# EAGLE design 7seg (EAGLE 6.6.0)
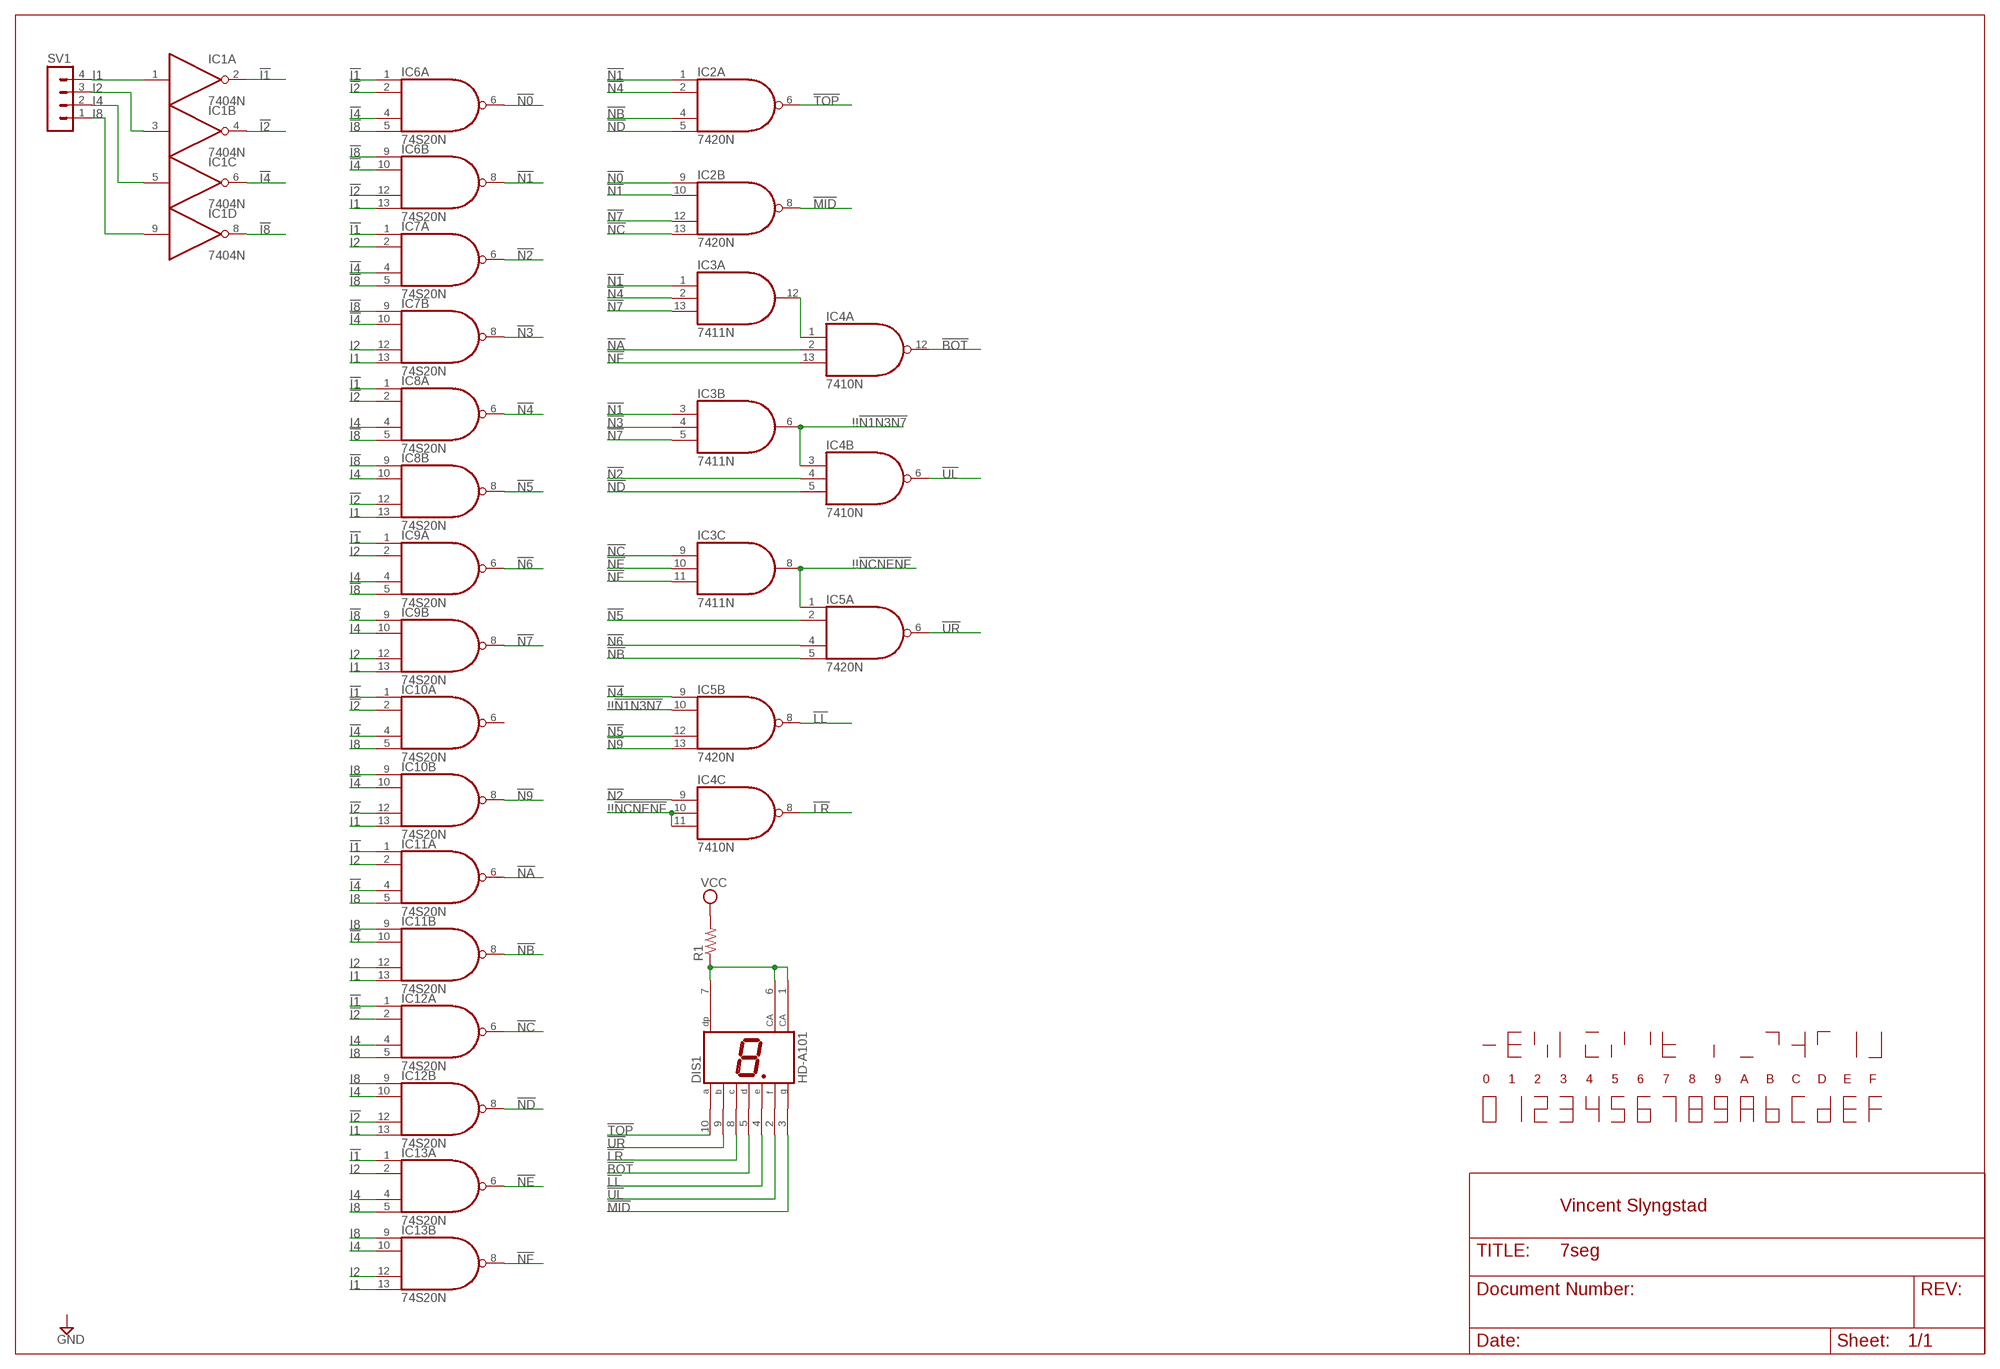
[diagram p0: schematic, sheet 1]

## Parts
DIS1  HD-A101  [HDSP-A]
IC1  7404N  [DIL14]
IC2  7420N  74S20N  [DIL14]
IC3  7411N  74S11N  [DIL14]
IC4  7410N  [DIL14]
IC5  7420N  74S20N  [DIL14]
IC6  74S20N  [DIL14]
IC7  74S20N  [DIL14]
IC8  74S20N  [DIL14]
IC9  74S20N  [DIL14]
IC10  74S20N  [DIL14]
IC11  74S20N  [DIL14]
IC12  74S20N  [DIL14]
IC13  74S20N  [DIL14]
R1  R-US_0207/10  [0207/10]
SV1  MA04-1  [MA04-1]

## Nets
!!!N1N3N7: IC3.6(B:O) IC4.3(B:I0) IC5.10(B:I1)
!!!NCNENF: IC3.8(C:O) IC4.10(C:I1) IC4.11(C:I2) IC5.1(A:I0)
!BOT: DIS1.5(D) IC4.12(A:O)
!I1: IC1.2(A:O) IC6.1(A:I0) IC7.1(A:I0) IC8.1(A:I0) IC9.1(A:I0) IC10.1(A:I0) IC11.1(A:I0) IC12.1(A:I0) IC13.1(A:I0)
!I2: IC1.4(B:O) IC6.2(A:I1) IC6.12(B:I2) IC8.2(A:I1) IC8.12(B:I2) IC10.2(A:I1) IC10.12(B:I2) IC12.2(A:I1) IC12.12(B:I2)
!I4: IC1.6(C:O) IC6.4(A:I2) IC6.10(B:I1) IC7.4(A:I2) IC7.10(B:I1) IC10.4(A:I2) IC10.10(B:I1) IC11.4(A:I2) IC11.10(B:I1)
!I8: IC1.8(D:O) IC6.5(A:I3) IC6.9(B:I0) IC7.5(A:I3) IC7.9(B:I0) IC8.5(A:I3) IC8.9(B:I0) IC9.5(A:I3) IC9.9(B:I0)
!LL: DIS1.4(E) IC5.8(B:O)
!LR: DIS1.8(C) IC4.8(C:O)
!MID: DIS1.3(G) IC2.8(B:O)
!N0: IC2.9(B:I0) IC6.6(A:O)
!N1: IC2.1(A:I0) IC2.10(B:I1) IC3.1(A:I0) IC3.3(B:I0) IC6.8(B:O)
!N2: IC4.4(B:I1) IC4.9(C:I0) IC7.6(A:O)
!N3: IC3.4(B:I1) IC7.8(B:O)
!N4: IC2.2(A:I1) IC3.2(A:I1) IC5.9(B:I0) IC8.6(A:O)
!N5: IC5.2(A:I1) IC5.12(B:I2) IC8.8(B:O)
!N6: IC5.4(A:I2) IC9.6(A:O)
!N7: IC2.12(B:I2) IC3.5(B:I2) IC3.13(A:I2) IC9.8(B:O)
!N9: IC5.13(B:I3) IC10.8(B:O)
!NA: IC4.2(A:I1) IC11.6(A:O)
!NB: IC2.4(A:I2) IC5.5(A:I3) IC11.8(B:O)
!NC: IC2.13(B:I3) IC3.9(C:I0) IC12.6(A:O)
!ND: IC2.5(A:I3) IC4.5(B:I2) IC12.8(B:O)
!NE: IC3.10(C:I1) IC13.6(A:O)
!NF: IC3.11(C:I2) IC4.13(A:I2) IC13.8(B:O)
!TOP: DIS1.10(A) IC2.6(A:O)
!UL: DIS1.2(F) IC4.6(B:O)
!UR: DIS1.9(B) IC5.6(A:O)
I1: IC1.1(A:I) IC6.13(B:I3) IC7.13(B:I3) IC8.13(B:I3) IC9.13(B:I3) IC10.13(B:I3) IC11.13(B:I3) IC12.13(B:I3) IC13.13(B:I3) SV1.4
I2: IC1.3(B:I) IC7.2(A:I1) IC7.12(B:I2) IC9.2(A:I1) IC9.12(B:I2) IC11.2(A:I1) IC11.12(B:I2) IC13.2(A:I1) IC13.12(B:I2) SV1.3
I4: IC1.5(C:I) IC8.4(A:I2) IC8.10(B:I1) IC9.4(A:I2) IC9.10(B:I1) IC12.4(A:I2) IC12.10(B:I1) IC13.4(A:I2) IC13.10(B:I1) SV1.2
I8: IC1.9(D:I) IC10.5(A:I3) IC10.9(B:I0) IC11.5(A:I3) IC11.9(B:I0) IC12.5(A:I3) IC12.9(B:I0) IC13.5(A:I3) IC13.9(B:I0) SV1.1
N$1: IC3.12(A:O) IC4.1(A:I0)
N$2: DIS1.1(CA) DIS1.6(CA) DIS1.7(DP) R1.1
VCC: R1.2
Unconnected: IC1.10(E:O) IC1.11(E:I) IC1.12(F:O) IC1.13(F:I) IC10.6(A:O)

## Notes on the sheet
- 0 | 1 | 2 | 3 | 4 | 5 | 6 | 7 | 8 | 9 | A | B | C | D | E | F
- Vincent Slyngstad

## Power pins joined to a net without a drawn wire
GND: IC1.7(P:GND) IC2.7(P:GND) IC3.7(P:GND) IC4.7(P:GND) IC5.7(P:GND) IC6.7(P:GND) IC7.7(P:GND) IC8.7(P:GND) IC9.7(P:GND) IC10.7(P:GND) IC11.7(P:GND) IC12.7(P:GND) IC13.7(P:GND)
VCC: IC1.14(P:VCC) IC2.14(P:VCC) IC3.14(P:VCC) IC4.14(P:VCC) IC5.14(P:VCC) IC6.14(P:VCC) IC7.14(P:VCC) IC8.14(P:VCC) IC9.14(P:VCC) IC10.14(P:VCC) IC11.14(P:VCC) IC12.14(P:VCC) IC13.14(P:VCC)

## Library data of the parts
DIS1 = display-hp:HD-A101: LED DISPLAY 1-character 7 segment, decimal point right; OC_FARNELL: unknown; OC_NEWARK: unknown
IC1 = 74xx-us:74*04: Hex INVERTER
IC2 IC5-IC13 = 74xx-us:74*20: Dual 4-input NAND gate
IC3 = 74xx-us:74*11: Triple 3-input AND gate
IC4 = 74xx-us:74*10: Triple 3-input NAND gate
R1 = rcl:R-US_: RESISTOR, American symbol
SV1 = con-lstb:MA04-1: PIN HEADER; OC_FARNELL: unknown; OC_NEWARK: unknown

## Board
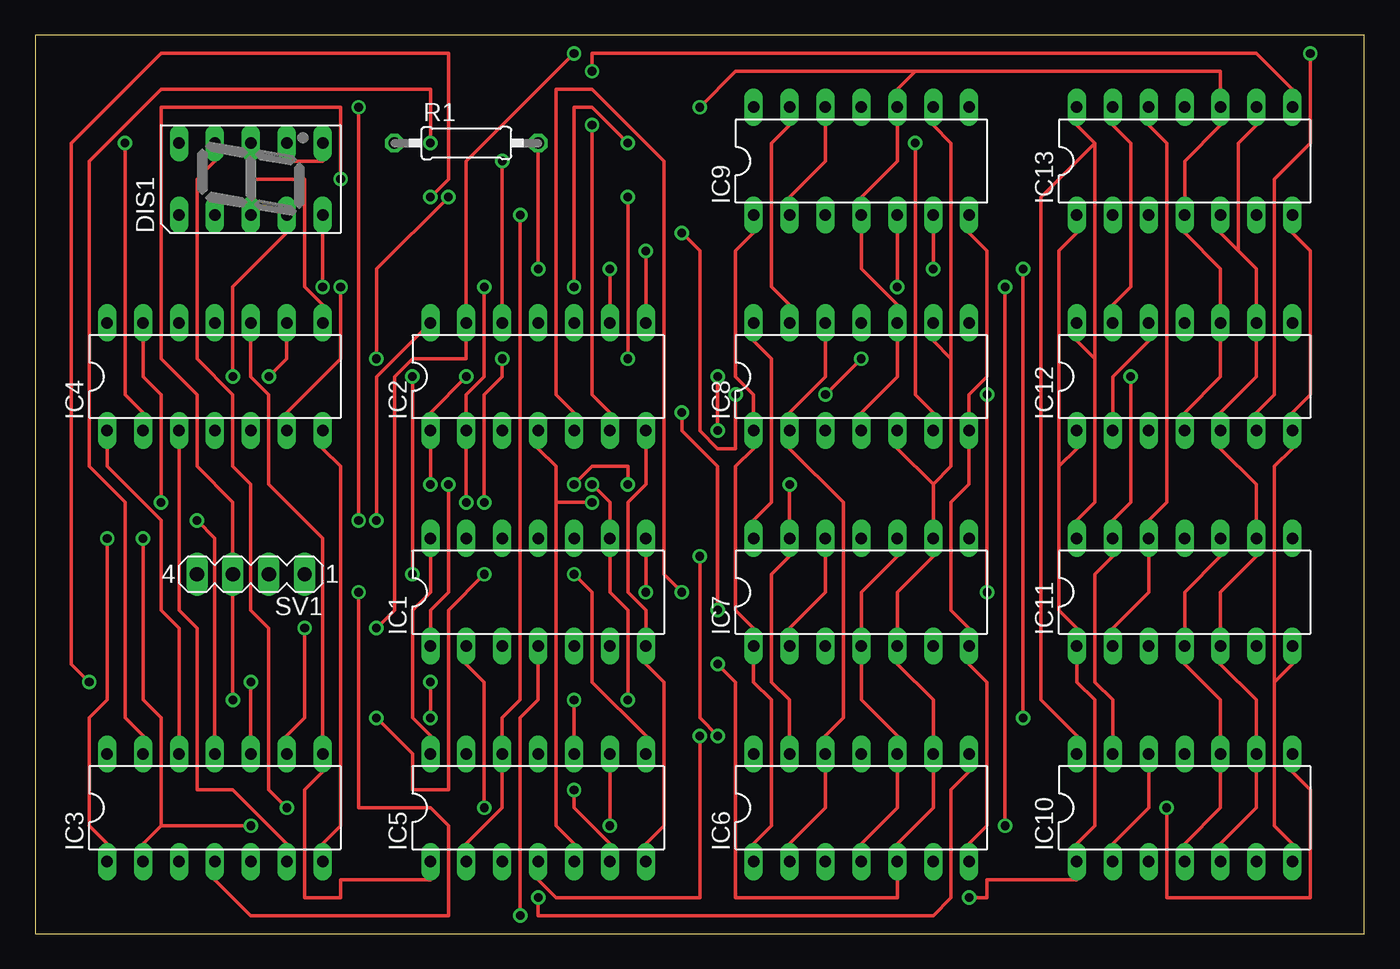
[diagram p1: board, top side]
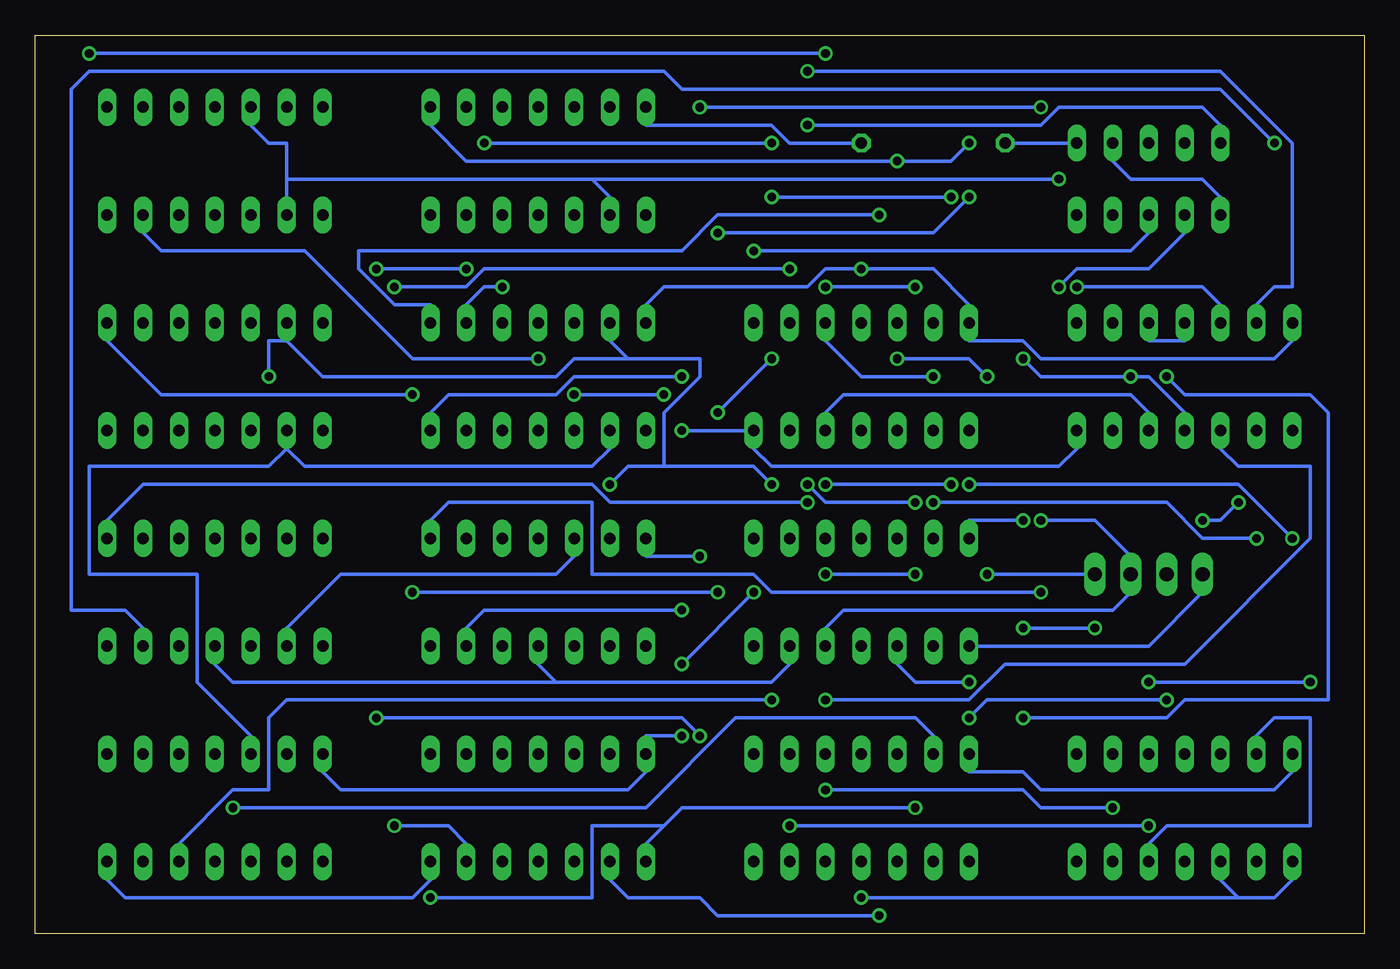
[diagram p2: board, bottom side, seen from below]

Size 93.98 x 63.5 mm. Coordinates in mm from the lower left corner, seen from the top.
Outline: 0,0 93.98,0 93.98,63.5 0,63.5 0,0
Copper layers (1*16): Top 0.035mm / dielectric 1.5mm / Bottom 0.035mm
Design rules "10mils": minimum track width 10mil, minimum drill 24mil, track to track 10mil, track to pad 10mil, pad to pad 10mil, via to via 10mil, smd to smd 10mil, copper to edge 25mil, drill to drill 10mil, minimum pad ring 10mil, minimum via ring 8mil, stop-mask expansion 0mil, vias tented up to drill 0mil, thermal gap 10mil

### Footprints (pad centres in the part's own frame; a part is rotated, then mirrored left to right if it is on the bottom)
HDSP-A = drill 0.813 long: 1 -2.54,5.08; 2 -2.54,2.54; 3 -2.54,0; 4 -2.54,-2.54; 5 -2.54,-5.08; 6 2.54,-5.08; 7 2.54,-2.54; 8 2.54,0; 9 2.54,2.54; 10 2.54,5.08
DIL14 = drill 0.813 long: 1 -7.62,-3.81; 2 -5.08,-3.81; 3 -2.54,-3.81; 4 0,-3.81; 5 2.54,-3.81; 6 5.08,-3.81; 7 7.62,-3.81; 8 7.62,3.81; 9 5.08,3.81; 10 2.54,3.81; 11 0,3.81; 12 -2.54,3.81; 13 -5.08,3.81; 14 -7.62,3.81
0207/10 = drill 0.813 octagon: 1 -5.08,0; 2 5.08,0
MA04-1 = drill 1.016 long: 1 -3.81,0; 2 -1.27,0; 3 1.27,0; 4 3.81,0

### Placement (x,y rotation side)
DIS1  15.24,53.34 90 top
IC1  35.56,24.13 0 top
IC2  35.56,39.37 0 top
IC3  12.7,8.89 0 top
IC4  12.7,39.37 0 top
IC5  35.56,8.89 0 top
IC6  58.42,8.89 0 top
IC7  58.42,24.13 0 top
IC8  58.42,39.37 0 top
IC9  58.42,54.61 0 top
IC10  81.28,8.89 0 top
IC11  81.28,24.13 0 top
IC12  81.28,39.37 0 top
IC13  81.28,54.61 0 top
R1  30.48,55.88 0 top
SV1  15.24,25.4 180 top

### Tracks (layer width: path | path; a pad name or v marks a point on that pad's centre or on a via)
!!!N1N3N7  (via drill 0.61)
  Top 0.254: IC3.6 17.78,6.35 13.97,10.16 11.43,10.16 11.43,21.59 10.16,22.86 IC4.3 | v38.1,16.51 IC5.10
  Bottom 0.254: v38.1,16.51 27.94,16.51 25.4,19.05 12.7,19.05 3.81,27.94 3.81,33.02 8.89,33.02 10.16,34.29 IC4.3
!!!NCNENF
  Top 0.254: IC5.1 27.94,3.81 21.59,3.81 21.59,2.54 19.05,2.54 19.05,10.16 20.32,11.43 IC3.8 20.32,27.94 16.51,31.75 16.51,38.1 15.24,39.37 IC4.10
  Bottom 0.254: IC4.11 12.7,41.91 15.24,41.91 IC4.10
!BOT  (via drill 0.61)
  Top 0.254: v20.32,45.72 DIS1.5
  Bottom 0.254: v20.32,45.72 11.43,45.72 10.16,44.45 IC4.12
!I1  (via drill 0.61)
  Top 0.254: 72.39,33.02 73.66,34.29 IC12.1 | 72.39,33.02 72.39,22.86 73.66,21.59 IC11.1 73.66,17.78 74.93,16.51 74.93,7.62 73.66,6.35 IC10.1 73.66,3.81 67.31,3.81 67.31,2.54 v66.04,2.54 | 72.39,33.02 72.39,48.26 73.66,49.53 IC13.1 | IC6.1 50.8,6.35 52.07,7.62 52.07,16.51 50.8,17.78 IC7.1 50.8,21.59 49.53,22.86 49.53,33.02 50.8,34.29 IC8.1 50.8,38.1 49.53,39.37 49.53,48.26 50.8,49.53 IC9.1 | v31.75,8.89 31.75,17.78 30.48,19.05 IC1.2
  Bottom 0.254: v31.75,8.89 48.26,8.89 49.53,7.62 | 49.53,7.62 50.8,6.35 IC6.1 | v66.04,2.54 54.61,2.54 54.61,7.62 49.53,7.62
!I2  (via drill 0.61)
  Top 0.254: IC10.2 76.2,6.35 78.74,8.89 IC10.12 | IC12.2 76.2,39.37 78.74,41.91 IC12.12 | IC8.12 55.88,39.37 53.34,36.83 IC8.2 53.34,34.29 57.15,30.48 57.15,15.24 55.88,13.97 IC6.12 55.88,8.89 53.34,6.35 IC6.2 | v34.29,1.27 34.29,15.24 35.56,16.51 IC1.4
  Bottom 0.254: 76.2,34.29 77.47,33.02 90.17,33.02 90.17,25.4 82.55,25.4 82.55,17.78 78.74,13.97 IC10.12 | v34.29,1.27 45.72,1.27 46.99,2.54 52.07,2.54 53.34,3.81 IC6.2 | 76.2,34.29 74.93,33.02 54.61,33.02 53.34,34.29 IC8.2 | 76.2,34.29 IC12.2
!I4
  Top 0.254: IC10.4 81.28,6.35 83.82,8.89 IC10.10 83.82,16.51 81.28,19.05 IC11.4 81.28,24.13 83.82,26.67 IC11.10 | IC6.4 58.42,6.35 60.96,8.89 IC6.10 60.96,13.97 58.42,16.51 IC7.4 58.42,24.13 60.96,26.67 IC7.10
  Bottom 0.254: 57.15,17.78 41.91,17.78 40.64,19.05 IC1.6 | 57.15,17.78 58.42,19.05 IC7.4 | 57.15,17.78 80.01,17.78 81.28,19.05 IC11.4
!I8  (via drill 0.61)
  Top 0.254: v48.26,19.05 49.53,17.78 49.53,2.54 60.96,2.54 IC6.5 60.96,6.35 63.5,8.89 IC6.9 63.5,16.51 60.96,19.05 IC7.5 60.96,24.13 63.5,26.67 IC7.9 63.5,31.75 | v43.18,24.13 IC1.8 | 63.5,31.75 60.96,34.29 IC8.5 | 64.77,40.64 63.5,41.91 IC8.9 | 64.77,40.64 64.77,33.02 63.5,31.75 | v60.96,45.72 IC9.5 | 64.77,40.64 64.77,55.88 63.5,57.15 IC9.9
  Bottom 0.254: v48.26,19.05 v43.18,24.13 | v60.96,45.72 62.23,45.72 63.5,44.45 IC8.9
!LL  (via drill 0.61)
  Top 0.254: v13.97,39.37 13.97,45.72 17.78,49.53 DIS1.4 | v24.13,15.24 26.67,12.7 26.67,10.16 29.21,10.16 29.21,22.86 v31.75,25.4 | v38.1,25.4 39.37,24.13 39.37,17.78 43.18,13.97 IC5.8
  Bottom 0.254: v13.97,39.37 12.7,38.1 3.81,38.1 2.54,36.83 2.54,16.51 12.7,16.51 13.97,15.24 v24.13,15.24 | v31.75,25.4 v38.1,25.4
!LR
  Top 0.254: IC4.8 20.32,44.45 19.05,45.72 19.05,53.34 15.24,53.34 DIS1.8
!MID  (via drill 0.61)
  Top 0.254: v43.18,48.26 IC2.8
  Bottom 0.254: v43.18,48.26 16.51,48.26 15.24,49.53 DIS1.3
!N0  (via drill 0.61)
  Top 0.254: v68.58,7.62 v68.58,45.72 | v40.64,46.99 IC2.9
  Bottom 0.254: v68.58,7.62 64.77,7.62 63.5,6.35 IC6.6 | v68.58,45.72 63.5,45.72 62.23,46.99 v40.64,46.99
!N1  (via drill 0.61)
  Top 0.254: v30.48,39.37 27.94,36.83 IC2.1 v27.94,31.75 | v35.56,2.54 35.56,1.27 63.5,1.27 64.77,2.54 64.77,10.16 66.04,11.43 IC6.8 | v5.08,27.94 5.08,16.51 3.81,15.24 3.81,7.62 5.08,6.35 IC3.1
  Bottom 0.254: v30.48,39.37 35.56,39.37 38.1,41.91 IC2.10 | 8.89,2.54 6.35,2.54 5.08,3.81 IC3.1 | 8.89,2.54 10.16,3.81 IC3.3 | 8.89,2.54 v35.56,2.54 | v27.94,31.75 8.89,31.75 v5.08,27.94
!N2  (via drill 0.61)
  Top 0.254: v16.51,39.37 17.78,40.64 IC4.9 | v48.26,22.86 48.26,33.02 45.72,35.56 v45.72,36.83 | v41.91,52.07 v41.91,40.64 | v29.21,52.07 24.13,46.99 v24.13,40.64
  Bottom 0.254: IC4.4 12.7,36.83 15.24,39.37 v16.51,39.37 22.86,39.37 v24.13,40.64 | v48.26,22.86 62.23,22.86 63.5,21.59 IC7.6 | v41.91,40.64 v45.72,36.83 | v29.21,52.07 v41.91,52.07
!N3  (via drill 0.61)
  Top 0.254: v22.86,24.13 22.86,8.89 27.94,8.89 29.21,7.62 29.21,1.27 15.24,1.27 12.7,3.81 IC3.4
  Bottom 0.254: v22.86,24.13 41.91,24.13 43.18,25.4 54.61,25.4 54.61,30.48 64.77,30.48 66.04,29.21 IC7.8
!N4  (via drill 0.61)
  Top 0.254: 8.89,7.62 7.62,6.35 IC3.2 | 8.89,7.62 v15.24,7.62 | v40.64,7.62 IC5.9 | v7.62,27.94 7.62,16.51 8.89,15.24 8.89,7.62 | v30.48,30.48 IC2.2 30.48,38.1 31.75,39.37 v31.75,45.72 | v62.23,55.88 62.23,38.1 63.5,36.83 IC8.6 | v41.91,55.88 39.37,58.42 38.1,58.42 v38.1,45.72
  Bottom 0.254: v15.24,7.62 v40.64,7.62 | v30.48,30.48 13.97,30.48 11.43,27.94 v7.62,27.94 | v41.91,55.88 v62.23,55.88 | v31.75,45.72 v38.1,45.72
!N5  (via drill 0.61)
  Top 0.254: IC5.2 30.48,6.35 33.02,8.89 IC5.12 33.02,15.24 34.29,16.51 v34.29,50.8
  Bottom 0.254: v34.29,50.8 45.72,50.8 48.26,48.26 71.12,48.26 71.12,46.99 68.58,44.45 66.04,44.45 IC8.8
!N6  (via drill 0.61)
  Top 0.254: v46.99,13.97 46.99,2.54 36.83,2.54 35.56,3.81 IC5.4 | v69.85,15.24 v69.85,46.99 | v63.5,46.99 IC9.6
  Bottom 0.254: v46.99,13.97 48.26,15.24 v69.85,15.24 | v69.85,46.99 v63.5,46.99
!N7  (via drill 0.61)
  Top 0.254: v33.02,54.61 IC2.12 | v27.94,55.88 27.94,59.69 8.89,59.69 3.81,54.61 3.81,33.02 6.35,30.48 6.35,15.24 7.62,13.97 IC3.13
  Bottom 0.254: IC3.13 7.62,13.97 6.35,15.24 3.81,15.24 3.81,7.62 13.97,7.62 15.24,6.35 IC3.5 | IC9.8 66.04,57.15 63.5,54.61 v33.02,54.61 29.21,54.61 v27.94,55.88
!N9  (via drill 0.61)
  Top 0.254: v80.01,8.89 80.01,2.54 90.17,2.54 90.17,10.16 88.9,11.43 IC10.8
  Bottom 0.254: v80.01,8.89 50.8,8.89 44.45,15.24 31.75,15.24 30.48,13.97 IC5.13
!NA  (via drill 0.61)
  Top 0.254: v6.35,55.88 6.35,38.1 7.62,36.83 IC4.2
  Bottom 0.254: v6.35,55.88 10.16,59.69 48.26,59.69 49.53,60.96 90.17,60.96 91.44,59.69 91.44,22.86 87.63,22.86 86.36,21.59 IC11.6
!NB  (via drill 0.61)
  Top 0.254: 36.83,30.48 36.83,7.62 38.1,6.35 IC5.5 | 36.83,30.48 36.83,33.02 35.56,34.29 IC2.4 | 36.83,30.48 v39.37,30.48
  Bottom 0.254: v39.37,30.48 53.34,30.48 54.61,31.75 86.36,31.75 88.9,29.21 IC11.8
!NC  (via drill 0.61)
  Top 0.254: v19.05,21.59 19.05,15.24 17.78,13.97 IC3.9 | v24.13,21.59 25.4,22.86 25.4,39.37 26.67,40.64 30.48,40.64 IC2.13 30.48,54.61 v38.1,62.23 | v90.17,62.23 90.17,55.88 87.63,53.34 87.63,38.1 86.36,36.83 IC12.6
  Bottom 0.254: v19.05,21.59 v24.13,21.59 | v38.1,62.23 v90.17,62.23
!ND  (via drill 0.61)
  Top 0.254: v67.31,24.13 v67.31,38.1 | v45.72,24.13 44.45,25.4 44.45,54.61 39.37,59.69 36.83,59.69 36.83,38.1 38.1,36.83 IC2.5
  Bottom 0.254: IC4.5 15.24,36.83 16.51,38.1 36.83,38.1 38.1,36.83 IC2.5 | v67.31,38.1 85.09,38.1 88.9,41.91 IC12.8 | v45.72,24.13 v67.31,24.13
!NE  (via drill 0.61)
  Top 0.254: v3.81,17.78 2.54,19.05 2.54,55.88 8.89,62.23 29.21,62.23 29.21,53.34 v27.94,52.07 | v45.72,49.53 46.99,48.26 46.99,35.56 48.26,34.29 49.53,34.29 v49.53,38.1 | v55.88,38.1 v58.42,40.64 | v15.24,17.78 IC3.10
  Bottom 0.254: v3.81,17.78 v15.24,17.78 | v27.94,52.07 30.48,49.53 v45.72,49.53 | v49.53,38.1 v55.88,38.1 | v58.42,40.64 67.31,40.64 74.93,48.26 85.09,48.26 86.36,49.53 IC13.6
!NF  (via drill 0.61)
  Top 0.254: v8.89,30.48 8.89,38.1 7.62,39.37 IC4.13 | v11.43,29.21 12.7,27.94 IC3.11 | v39.37,60.96 39.37,62.23 86.36,62.23 88.9,59.69 IC13.8
  Bottom 0.254: v8.89,30.48 10.16,29.21 v11.43,29.21 | v39.37,60.96 10.16,60.96 5.08,55.88 5.08,45.72 6.35,45.72 7.62,44.45 IC4.13
!TOP  (via drill 0.61)
  Top 0.254: v39.37,57.15 39.37,38.1 40.64,36.83 IC2.6
  Bottom 0.254: v39.37,57.15 22.86,57.15 21.59,58.42 11.43,58.42 10.16,57.15 DIS1.10
!UL  (via drill 0.61)
  Top 0.254: v21.59,45.72 21.59,40.64 17.78,36.83 IC4.6
  Bottom 0.254: v21.59,45.72 20.32,46.99 15.24,46.99 12.7,49.53 DIS1.2
!UR  (via drill 0.61)
  Top 0.254: v38.1,10.16 38.1,8.89 40.64,6.35 IC5.6 | v17.78,8.89 16.51,10.16 16.51,21.59 15.24,22.86 15.24,31.75 13.97,33.02 13.97,38.1 11.43,40.64 11.43,53.34 12.7,54.61 DIS1.9
  Bottom 0.254: v38.1,10.16 24.13,10.16 22.86,8.89 v17.78,8.89
GND  (via drill 0.61)
  Top 0.254: IC5.7 43.18,6.35 44.45,7.62 44.45,17.78 43.18,19.05 IC1.7 43.18,22.86 41.91,24.13 41.91,30.48 43.18,31.75 IC2.7 | IC3.7 20.32,6.35 21.59,7.62 21.59,33.02 20.32,34.29 IC4.7 | IC6.7 66.04,6.35 67.31,7.62 67.31,17.78 66.04,19.05 IC7.7 66.04,21.59 64.77,22.86 64.77,30.48 66.04,31.75 IC8.7 66.04,38.1 67.31,39.37 67.31,48.26 66.04,49.53 IC9.7 | 87.63,17.78 87.63,7.62 88.9,6.35 IC10.7 | 87.63,17.78 88.9,19.05 IC11.7 | 87.63,17.78 87.63,33.02 88.9,34.29 IC12.7 88.9,36.83 90.17,38.1 90.17,48.26 88.9,49.53 IC13.7 | v48.26,35.56 v48.26,39.37
  Bottom 0.254: IC4.7 20.32,34.29 21.59,33.02 41.91,33.02 43.18,34.29 IC2.7 v48.26,35.56 | IC6.7 66.04,3.81 67.31,2.54 87.63,2.54 88.9,3.81 IC10.7 | v48.26,39.37 55.88,39.37 57.15,38.1 64.77,38.1 66.04,36.83 IC8.7
I1  (via drill 0.61)
  Top 0.254: IC10.13 76.2,16.51 74.93,17.78 74.93,25.4 76.2,26.67 IC11.13 76.2,29.21 77.47,30.48 v77.47,39.37 | IC12.13 76.2,44.45 77.47,45.72 77.47,55.88 76.2,57.15 IC13.13 | IC6.13 53.34,16.51 52.07,17.78 52.07,25.4 53.34,26.67 IC7.13 v53.34,31.75 | IC8.13 53.34,44.45 52.07,45.72 52.07,55.88 53.34,57.15 IC9.13 | v29.21,31.75 29.21,24.13 27.94,22.86 IC1.1 | v38.1,31.75 39.37,33.02 41.91,33.02 v41.91,31.75
  Bottom 0.254: v77.47,39.37 77.47,41.91 76.2,41.91 | IC1.1 15.24,20.32 11.43,24.13 SV1.4 | v53.34,31.75 52.07,33.02 49.53,33.02 | 49.53,33.02 49.53,36.83 46.99,39.37 46.99,40.64 52.07,40.64 | 52.07,40.64 53.34,41.91 IC8.13 | v29.21,31.75 v38.1,31.75 | v41.91,31.75 43.18,33.02 49.53,33.02 | 76.2,41.91 73.66,39.37 57.15,39.37 55.88,40.64 52.07,40.64 | 76.2,41.91 IC12.13
I2  (via drill 0.61)
  Top 0.254: IC7.2 53.34,21.59 55.88,24.13 IC7.12 | IC11.2 76.2,21.59 78.74,24.13 IC11.12 78.74,29.21 80.01,30.48 80.01,55.88 78.74,57.15 IC13.12 | v27.94,15.24 v27.94,17.78 | v13.97,16.51 SV1.3 13.97,30.48 11.43,33.02 11.43,38.1 8.89,40.64 8.89,58.42 21.59,58.42 v21.59,53.34 | IC9.2 53.34,52.07 55.88,54.61 IC9.12
  Bottom 0.254: IC7.12 55.88,26.67 57.15,25.4 72.39,25.4 76.2,21.59 IC11.2 | v27.94,17.78 31.75,17.78 33.02,19.05 IC1.3 | v27.94,15.24 26.67,16.51 v13.97,16.51 | 76.2,53.34 76.2,55.88 77.47,55.88 78.74,57.15 IC13.12 | 76.2,53.34 IC13.2 | 54.61,53.34 53.34,52.07 IC9.2 | 54.61,53.34 76.2,53.34 | v21.59,53.34 54.61,53.34
I4  (via drill 0.61)
  Top 0.254: IC8.4 58.42,36.83 60.96,39.37 IC8.10 60.96,44.45 58.42,46.99 IC9.4 58.42,52.07 60.96,54.61 IC9.10 60.96,59.69 62.23,60.96 | IC12.4 81.28,36.83 83.82,39.37 IC12.10 83.82,46.99 81.28,49.53 IC13.4 81.28,54.61 83.82,57.15 IC13.10 83.82,60.96 62.23,60.96 | v22.86,29.21 v22.86,58.42 | v46.99,58.42 49.53,60.96 62.23,60.96
  Bottom 0.254: IC1.5 38.1,21.59 36.83,22.86 17.78,22.86 16.51,24.13 SV1.2 16.51,26.67 19.05,29.21 v22.86,29.21 | v22.86,58.42 v46.99,58.42
I8  (via drill 0.61)
  Top 0.254: 85.09,48.26 86.36,46.99 IC12.9 86.36,39.37 83.82,36.83 IC12.5 83.82,34.29 86.36,31.75 IC11.9 86.36,26.67 83.82,24.13 IC11.5 83.82,19.05 86.36,16.51 IC10.9 86.36,8.89 83.82,6.35 IC10.5 | 85.09,48.26 83.82,49.53 IC13.5 | 85.09,48.26 85.09,55.88 86.36,57.15 IC13.9 | v41.91,16.51 41.91,22.86 40.64,24.13 IC1.9 40.64,30.48 v39.37,31.75 | v26.67,25.4 v26.67,39.37 | v33.02,40.64 33.02,39.37 31.75,38.1 v31.75,30.48
  Bottom 0.254: v41.91,16.51 76.2,16.51 77.47,15.24 77.47,10.16 80.01,10.16 83.82,6.35 IC10.5 | SV1.1 v26.67,25.4 | v26.67,39.37 27.94,40.64 v33.02,40.64 | v31.75,30.48 38.1,30.48 v39.37,31.75
N$1
  Top 0.254: IC3.12 10.16,21.59 8.89,22.86 8.89,29.21 5.08,33.02 IC4.1
N$2
  Top 0.254: DIS1.6 20.32,54.61 17.78,54.61 DIS1.7
  Bottom 0.254: DIS1.1 10.16,52.07 11.43,53.34 16.51,53.34 17.78,54.61 DIS1.7 | DIS1.6 R1.1
VCC  (via drill 0.61)
  Top 0.254: 74.93,40.64 74.93,30.48 73.66,29.21 IC11.14 | 74.93,40.64 73.66,41.91 IC12.14 | 74.93,55.88 73.66,57.15 IC13.14 | 74.93,55.88 74.93,40.64 | 74.93,55.88 71.12,52.07 71.12,16.51 73.66,13.97 IC10.14 | IC1.14 27.94,24.13 26.67,22.86 26.67,15.24 27.94,13.97 IC5.14 | IC7.14 50.8,29.21 52.07,30.48 52.07,40.64 50.8,41.91 IC8.14 | v35.56,46.99 R1.2 | v24.13,29.21 24.13,39.37 IC2.14 | v48.26,13.97 46.99,15.24 v46.99,26.67
  Bottom 0.254: IC10.14 73.66,11.43 72.39,10.16 52.07,10.16 50.8,11.43 IC6.14 50.8,13.97 v48.26,13.97 | IC3.14 5.08,11.43 6.35,10.16 22.86,10.16 24.13,11.43 27.94,11.43 IC5.14 | R1.2 40.64,55.88 41.91,57.15 50.8,57.15 IC9.14 | IC4.14 5.08,41.91 6.35,40.64 22.86,40.64 24.13,41.91 27.94,41.91 IC2.14 27.94,44.45 30.48,46.99 v35.56,46.99 38.1,46.99 39.37,45.72 49.53,45.72 50.8,44.45 IC8.14 | v24.13,29.21 27.94,29.21 IC1.14 | v46.99,26.67 50.8,26.67 IC7.14